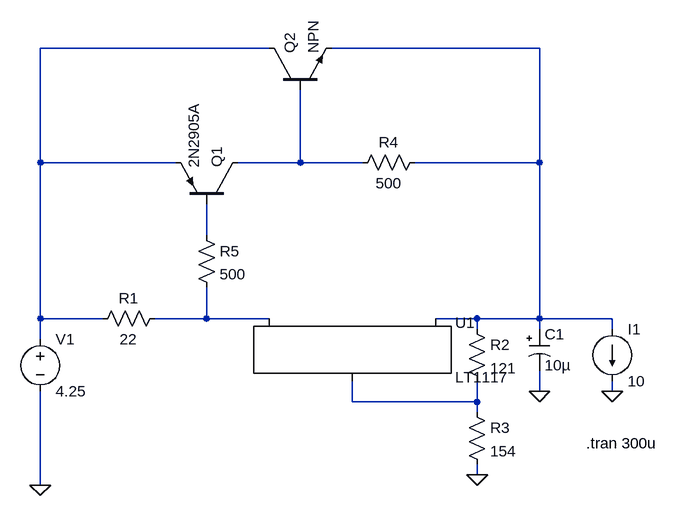
[diagram p0: schematic final_output.asc]
final_output.asc, the LTspice schematic file:
Version 4
SHEET 1 1108 680
WIRE 96 -240 -256 -240
WIRE 512 -240 192 -240
WIRE -256 -64 -256 -240
WIRE -48 -64 -256 -64
WIRE 144 -64 144 -176
WIRE 144 -64 48 -64
WIRE 240 -64 144 -64
WIRE 512 -64 512 -240
WIRE 512 -64 320 -64
WIRE 0 48 0 0
WIRE -256 176 -256 -64
WIRE -160 176 -256 176
WIRE 0 176 0 128
WIRE 0 176 -80 176
WIRE 96 176 0 176
WIRE 416 176 352 176
WIRE 512 176 512 -64
WIRE 512 176 416 176
WIRE 624 176 512 176
WIRE 416 192 416 176
WIRE 512 192 512 176
WIRE 624 192 624 176
WIRE -256 208 -256 176
WIRE 512 288 512 256
WIRE 624 288 624 272
WIRE 224 304 224 272
WIRE 416 304 416 272
WIRE 416 304 224 304
WIRE 416 320 416 304
WIRE 416 416 416 400
WIRE -256 432 -256 288
FLAG -256 432 0
FLAG 512 288 0
FLAG 624 288 0
FLAG 416 416 0
SYMBOL PowerProducts\\LT1117 224 176 R0
SYMATTR InstName U1
SYMBOL polcap 496 192 R0
WINDOW 3 24 56 Left 2
SYMATTR Value 10µ
SYMATTR InstName C1
SYMATTR Description Capacitor
SYMATTR Type cap
SYMATTR SpiceLine V=33 Irms=0 Rser=0.3 Lser=0 mfg="KEMET" pn="T495D106M035AS" type="Tantalum"
SYMBOL voltage -256 192 R0
SYMATTR InstName V1
SYMATTR Value 4.25
SYMBOL res 400 176 R0
SYMATTR InstName R2
SYMATTR Value 121
SYMBOL res 400 304 R0
SYMATTR InstName R3
SYMATTR Value 154
SYMBOL current 624 192 R0
WINDOW 123 0 0 Left 0
WINDOW 39 0 0 Left 0
SYMATTR InstName I1
SYMATTR Value 10
SYMBOL res -64 160 R90
WINDOW 0 0 56 VBottom 2
WINDOW 3 32 56 VTop 2
SYMATTR InstName R1
SYMATTR Value 22
SYMATTR SpiceLine tol=5
SYMBOL pnp2 48 0 M270
SYMATTR InstName Q1
SYMATTR Value 2N2905A
SYMBOL res 336 -80 R90
WINDOW 0 0 56 VBottom 2
WINDOW 3 32 56 VTop 2
SYMATTR InstName R4
SYMATTR Value 500
SYMATTR SpiceLine tol=5
SYMBOL npn2 96 -176 R270
SYMATTR InstName Q2
SYMBOL res -16 32 R0
SYMATTR InstName R5
SYMATTR Value 500
SYMATTR SpiceLine tol=5
TEXT 584 368 Left 2 !.tran 300u

The netlist it stands for:
* final_output.asc
XU1 N006 N002 N005 LT1117
C1 N002 0 10µ V=33 Irms=0 Rser=0.3 Lser=0 mfg="KEMET" pn="T495D106M035AS" type="Tantalum"
V1 N001 0 4.25
R2 N002 N006 121
R3 N006 0 154
I1 N002 0 10
R1 N005 N001 22 tol=5
Q1 N003 N004 N001 0 2N2905A
R4 N002 N003 500 tol=5
Q2 N001 N003 N002 0 NPN
R5 N004 N005 500 tol=5
.model NPN NPN
.model PNP PNP
.lib standard.bjt
.tran 300u
.lib LT1117.lib
.backanno
.end